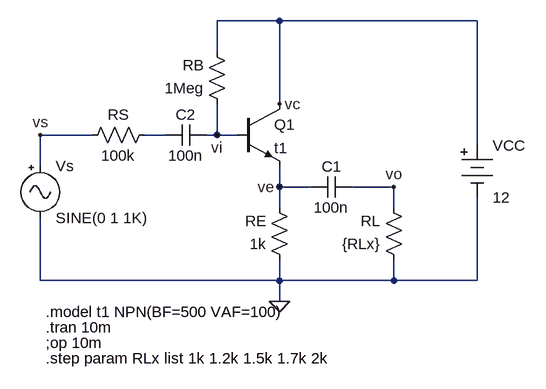
[diagram p0: schematic 3_12_pablo_gomez_tp5_ej1.asc]
3_12_pablo_gomez_tp5_ej1.asc, the LTspice schematic file:
Version 4
SHEET 1 880 680
WIRE 384 -96 288 -96
WIRE 688 -96 384 -96
WIRE 288 -48 288 -96
WIRE 384 32 384 -96
WIRE 96 80 16 80
WIRE 208 80 176 80
WIRE 288 80 288 32
WIRE 288 80 272 80
WIRE 320 80 288 80
WIRE 688 96 688 -96
WIRE 16 128 16 80
WIRE 384 160 384 128
WIRE 432 160 384 160
WIRE 560 160 496 160
WIRE 384 192 384 160
WIRE 560 192 560 160
WIRE 16 304 16 208
WIRE 384 304 384 272
WIRE 384 304 16 304
WIRE 560 304 560 272
WIRE 560 304 384 304
WIRE 688 304 688 176
WIRE 688 304 560 304
WIRE 384 336 384 304
FLAG 384 336 0
FLAG 16 80 vs
FLAG 288 80 vi
FLAG 560 160 vo
FLAG 384 160 ve
FLAG 384 32 vc
SYMBOL Misc\\signal 16 112 R0
SYMATTR InstName Vs
SYMBOL res 192 64 R90
WINDOW 0 0 56 VBottom 2
WINDOW 3 32 56 VTop 2
SYMATTR InstName RS
SYMATTR Value 100k
SYMBOL res 304 48 R180
WINDOW 0 36 76 Left 2
WINDOW 3 36 40 Left 2
SYMATTR InstName RB
SYMATTR Value 1Meg
SYMBOL res 400 288 R180
WINDOW 0 36 76 Left 2
WINDOW 3 36 40 Left 2
SYMATTR InstName RE
SYMATTR Value 1k
SYMBOL res 576 288 R180
WINDOW 0 36 76 Left 2
WINDOW 3 36 40 Left 2
SYMATTR InstName RL
SYMATTR Value {RLx}
SYMBOL cap 496 144 R90
WINDOW 0 0 32 VBottom 2
WINDOW 3 32 32 VTop 2
SYMATTR InstName C1
SYMATTR Value 100n
SYMBOL cap 272 64 R90
WINDOW 0 0 32 VBottom 2
WINDOW 3 32 32 VTop 2
SYMATTR InstName C2
SYMATTR Value 100n
SYMBOL npn 320 32 R0
SYMATTR InstName Q1
SYMATTR Value t1
SYMBOL Misc\\battery 688 80 R0
WINDOW 123 0 0 Left 0
WINDOW 39 0 0 Left 0
SYMATTR InstName VCC
SYMATTR Value 12
TEXT 24 352 Left 2 !.model t1 NPN(BF=500 VAF=100)
TEXT 24 400 Left 2 !;op 10m
TEXT 24 376 Left 2 !.tran 10m
TEXT 24 424 Left 2 !.step param RLx list 1k 1.2k 1.5k 1.7k 2k

The netlist it stands for:
* 3_12_pablo_gomez_tp5_ej1.asc
Vs vs 0 SINE(0 1 1K)
RS N001 vs 100k
RB vi vc 1Meg
RE 0 ve 1k
RL 0 vo {RLx}
C1 vo ve 100n
C2 vi N001 100n
Q1 vc vi ve 0 t1
VCC vc 0 12
.model NPN NPN
.model PNP PNP
.lib standard.bjt
.model t1 NPN(BF=500 VAF=100)
;op 10m
.tran 10m
.step param RLx list 1k 1.2k 1.5k 1.7k 2k
.backanno
.end